# EAGLE design Geniric_220VAC_24VDC_cup_wash (EAGLE 8.5.1)

## Sheet 1 of 2: 220v AC INPUT
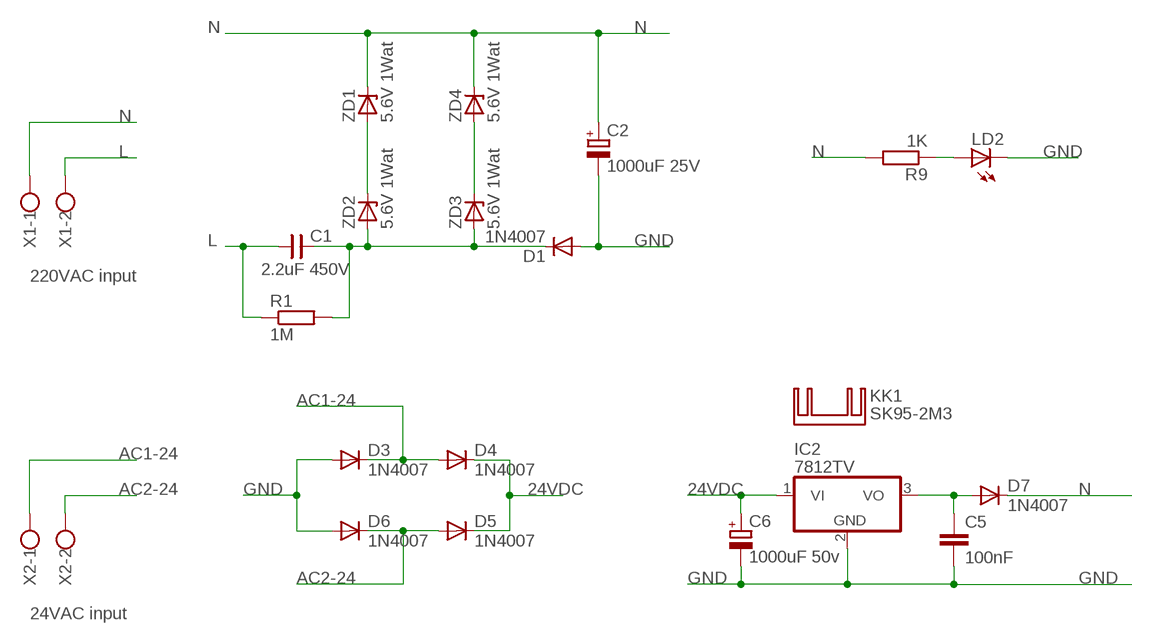
[diagram p0: schematic, sheet 1]

### Parts
C1  2.2uF 450V  CNP-C150-190X070  [C150-190X070]
C2  1000uF 25V  CPOL-EUE5-8.5  [E5-8,5]
C5  100nF  C-EU050-025X075  [C050-025X075]
C6  1000uF 50v  CPOL-EUE5-13  [E5-13]
D1  1N4007  1N4004  [DO41-10]
D3  1N4007  1N4004  [DO41-10]
D4  1N4007  1N4004  [DO41-10]
D5  1N4007  1N4004  [DO41-10]
D6  1N4007  1N4004  [DO41-10]
D7  1N4007  1N4004  [DO41-10]
IC2  7812TV  [TO220V]
KK1  SK95-2M3  [SK95-2M3]
LD2  LED5MM  [LED5MM]
R1  1M  R-EU_0207/10  [0207/10]
R9  1K  R-EU_0207/10  [0207/10]
X1  W237-102  [W237-102]
X2  W237-102  [W237-102]
ZD1  5.6V 1Wat  ZD-DO35Z10  [DO35Z10]
ZD2  5.6V 1Wat  ZD-DO35Z10  [DO35Z10]
ZD3  5.6V 1Wat  ZD-DO35Z10  [DO35Z10]
ZD4  5.6V 1Wat  ZD-DO35Z10  [DO35Z10]

### Nets
24VDC: C6.+ D4.C D5.C IC2.1(VI) ; also sheet 2
AC1-24: D3.C D4.A X2.1 ; also sheet 2
AC2-24: D5.A D6.C X2.2 ; also sheet 2
GND: C2.- C5.2 C6.- D1.A D3.A D6.A IC2.2(GND) LD2.K(C) ; also sheet 2
L: C1.1 R1.1 X1.2 ; also sheet 2
N: C2.+ D7.C R9.2 X1.1 ZD1.C ZD4.C ; also sheet 2
N$4: C1.2 D1.C R1.2 ZD2.A ZD3.A
N$7: ZD1.A ZD2.C
N$8: ZD3.C ZD4.A
N$9: LD2.A R9.1
NDDD: C5.1 D7.A IC2.3(VO)

### Notes on the sheet
- 220VAC input
- 24VAC input

## Sheet 2 of 2
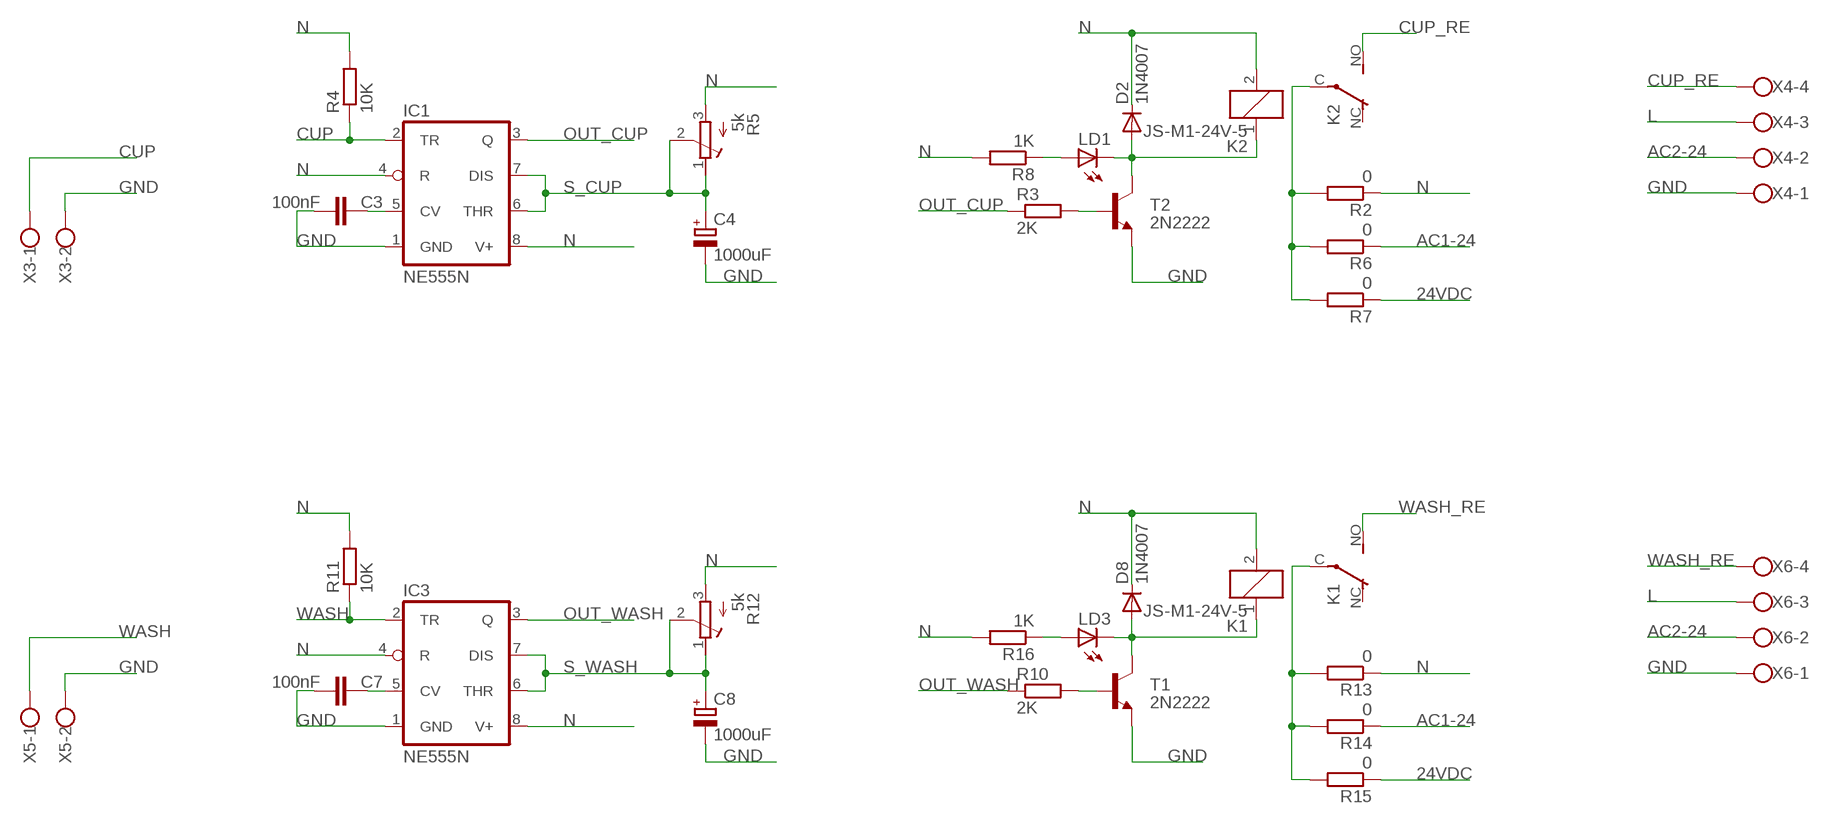
[diagram p1: schematic, sheet 2]

### Parts
C3  100nF  C-EU050-025X075  [C050-025X075]
C4  1000uF  CPOL-EUE5-8.5  [E5-8,5]
C7  100nF  C-EU050-025X075  [C050-025X075]
C8  1000uF  CPOL-EUE5-8.5  [E5-8,5]
D2  1N4007  1N4004  [DO41-10]
D8  1N4007  1N4004  [DO41-10]
IC1  NE555N  [DIL08-ROUND]
IC3  NE555N  [DIL08-ROUND]
K1  JS-M1-24V-5  JS-M1-12V-5  [JS-M]
K2  JS-M1-24V-5  JS-M1-12V-5  [JS-M]
LD1  LED5MM  [LED5MM]
LD3  LED5MM  [LED5MM]
R2  0  R-EU_0207/10  [0207/10]
R3  2K  R-EU_0207/10  [0207/10]
R4  10K  R-EU_0207/10  [0207/10]
R5  5k  R-TRIMMT93XA  [RTRIMT93XA]
R6  0  R-EU_0207/10  [0207/10]
R7  0  R-EU_0207/10  [0207/10]
R8  1K  R-EU_0207/10  [0207/10]
R10  2K  R-EU_0207/10  [0207/10]
R11  10K  R-EU_0207/10  [0207/10]
R12  5k  R-TRIMMT93XA  [RTRIMT93XA]
R13  0  R-EU_0207/10  [0207/10]
R14  0  R-EU_0207/10  [0207/10]
R15  0  R-EU_0207/10  [0207/10]
R16  1K  R-EU_0207/10  [0207/10]
T1  2N2222  [TO92-EBC-OVAL]
T2  2N2222  [TO92-EBC-OVAL]
X3  W237-102  [W237-102]
X4  W237-4  [W237-4]
X5  W237-102  [W237-102]
X6  W237-4  [W237-4]

### Nets
24VDC: R7.1 R15.1 ; also sheet 1
AC1-24: R6.1 R14.1 ; also sheet 1
AC2-24: X4.2 X6.2 ; also sheet 1
CUP: IC1.2(TR) R4.1 X3.1
CUP_RE: K2.NO(2:S) X4.4
GND: C3.2 C4.- C7.2 C8.- IC1.1(GND) IC3.1(GND) T1.E T2.E X3.2 X4.1 X5.2 X6.1 ; also sheet 1
L: X4.3 X6.3 ; also sheet 1
N: D2.C D8.C IC1.4(R) IC1.8(V+) IC3.4(R) IC3.8(V+) K1.2 K2.2 R2.1 R4.2 R5.3(A) R8.2 R11.2 R12.3(A) R13.1 R16.2 ; also sheet 1
N$1: R3.2 T2.B
N$2: C3.1 IC1.5(CV)
N$3: D2.A K2.1 LD1.K(C) T2.C
N$5: C7.1 IC3.5(CV)
N$6: LD1.A R8.1
N$10: K2.C(2:P) R2.2 R6.2 R7.2
N$11: D8.A K1.1 LD3.K(C) T1.C
N$12: R10.2 T1.B
N$13: K1.C(2:P) R13.2 R14.2 R15.2
N$14: LD3.A R16.1
OUT_CUP: IC1.3(Q) R3.1
OUT_WASH: IC3.3(Q) R10.1
S_CUP: C4.+ IC1.6(THR) IC1.7(DIS) R5.1(E) R5.2(S)
S_WASH: C8.+ IC3.6(THR) IC3.7(DIS) R12.1(E) R12.2(S)
WASH: IC3.2(TR) R11.1 X5.1
WASH_RE: K1.NO(2:S) X6.4
Unconnected: K1.NC(2:O) K2.NC(2:O)

## Library data of the parts
C1 = cap-master:CNP-: NON-POLARIZED CAP
C2 C4 C6 C8 = rcl:CPOL-EU: POLARIZED CAPACITOR, European symbol; SPICEPREFIX: C
C3 C5 C7 = rcl:C-EU: CAPACITOR, European symbol; SPICEPREFIX: C
D1-D8 = adafruit:1N4004: DIODE General purpose 1N400x type rectifier (With bigger pads) http://www.ladyada.net/library/pcb/eaglelibrary.html
IC1 IC3 = adafruit:*555: TIMER Changed DIP package to have round (not oval) pin pads http://www.ladyada.net/library/pcb/eaglelibrary.html
IC2 = linear:78*: Positive VOLTAGE REGULATOR Source: http://cache.national.com/ds/LM/LM78L05.pdf http://www.fairchildsemi.com/ds/LM/LM7805.pdf
K1 K2 = relay:JS-M1*: Automotive Ultra-Miniature Power Relay NAiS Source: http://www.mew-europe.com/.. en_ds_61211_0000.pdf; MF: FARNELL; MPN: JSM1-12V-5; OC_FARNELL: 910351; OC_NEWARK: 14J1764
KK1 = heatsink:SK95-2M3: HEATSINK manufacturer Fischer/distributor Buerklin
LD1-LD3 = led:LED: LED OSRAM: - CHIPLED LG R971, LG N971, LY N971, LG Q971, LY Q971, LO R971, LY R971 LH N974, LH R974 LS Q976, LO Q976, LY Q976 LO Q996 - Hyper CHIPLED LW Q18S LB Q993, LB Q99A, LB R99A - SideLED LS A670, LO A670, LY A670, LG A670, LP A670 LB A673, LV A673, LT A673, LW A673 LH A674 LY A675 LS A676, LA A676, LO A676, LY A676, LW A676 LS A679, LY A679, LG A679 - Hyper Micro SIDELED® LS Y876, LA Y876, LO Y876, LY Y876 LT Y87S - SmartLED LW L88C, LW L88S LB L89C, LB L89S, LG L890 LS L89K, LO L89K, LY L89K LS L896, LA L896, LO L896, LY L896 - TOPLED LS T670, LO T670, LY T670, LG T670, LP T670 LSG T670, LSP T670, LSY T670, LOP T670, LYG T670 LG T671, LOG T671, LSG T671 LB T673, LV T673, LT T673, LW T673 LH T674 LS T676, LA T676, LO T676, LY T676, LB T676, LH T676, LSB T676, LW T676 LB T67C, LV T67C, LT T67C, LS T67K, LO T67K, LY T67K, LW E67C LS E67B, LA E67B, LO E67B, LY E67B, LB E67C, LV E67C, LT E67C LW T67C LS T679, LY T679, LG T679 LS T770, LO T770, LY T770, LG T770, LP T770 LB T773, LV T773, LT T773, LW T773 LH T774 LS E675, LA E675, LY E675, LS T675 LS T776, LA T776, LO T776, LY T776, LB T776 LHGB T686 LT T68C, LB T68C - Hyper Mini TOPLED® LB M676 - Mini TOPLED Santana® LG M470 LS M47K, LO M47K, LY M47K Source: http://www.osram.convergy.de/
R1 = rcl:R-EU_: RESISTOR, European symbol; SPICEPREFIX: R
R2-R4 R6-R11 R13-R16 = rcl-2:R-EU_: RESISTOR, European symbol
R5 R12 = rcl:R-TRIMM: Trimm resistor; SPICEMODEL: X; SPICEPREFIXL: POT
T1 T2 = adafruit:2N2222: NPN TRANSISTOR Big oval pads
X1-X3 X5 = con-wago-500:W237-102: WAGO SCREW CLAMP
X4 X6 = con-wago-500:W237-4: WAGO SCREW CLAMP; OC_FARNELL: unknown; OC_NEWARK: unknown
ZD1-ZD4 = diodes:ZD-: Zener diode

## Board
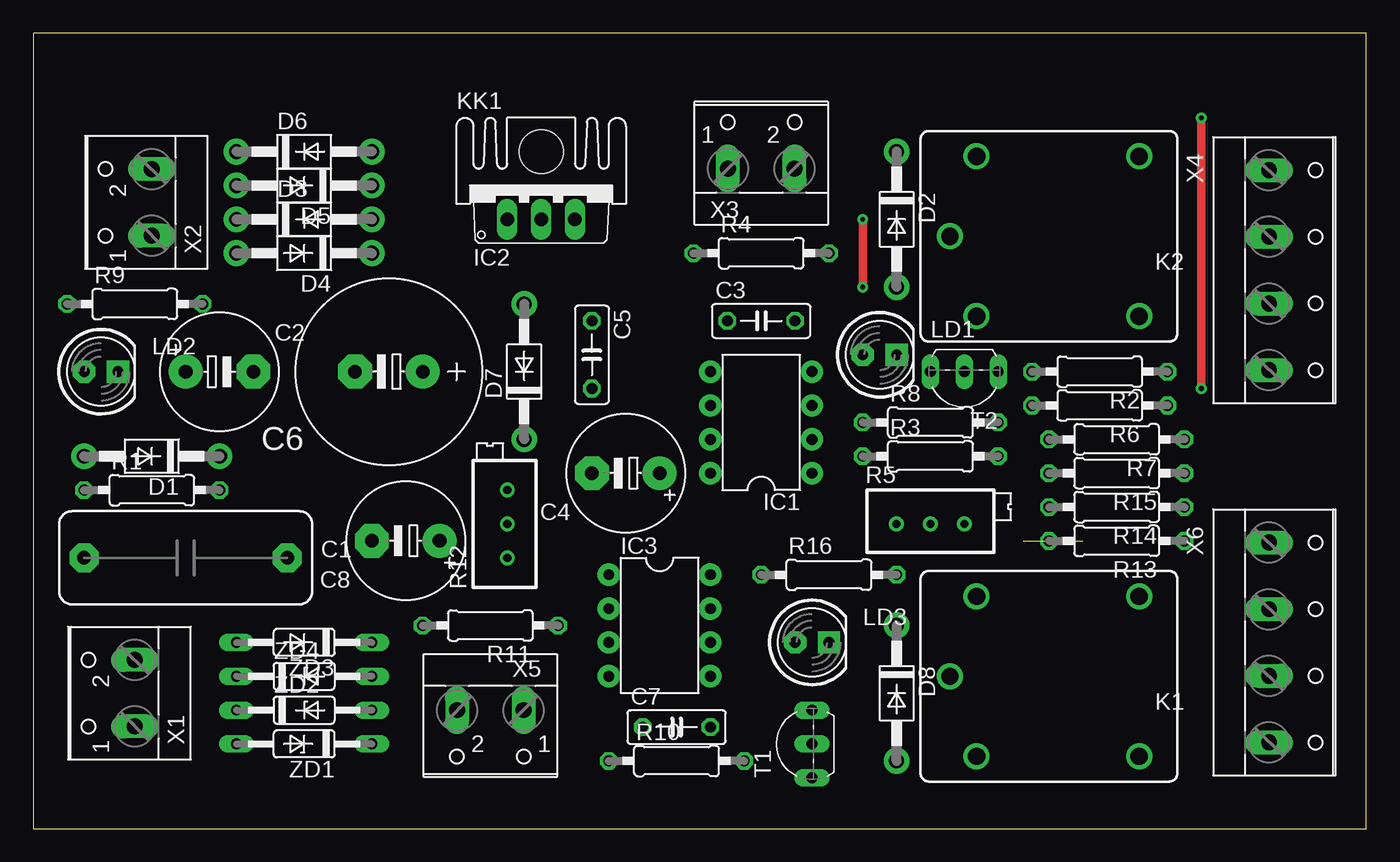
[diagram p2: board, top side]
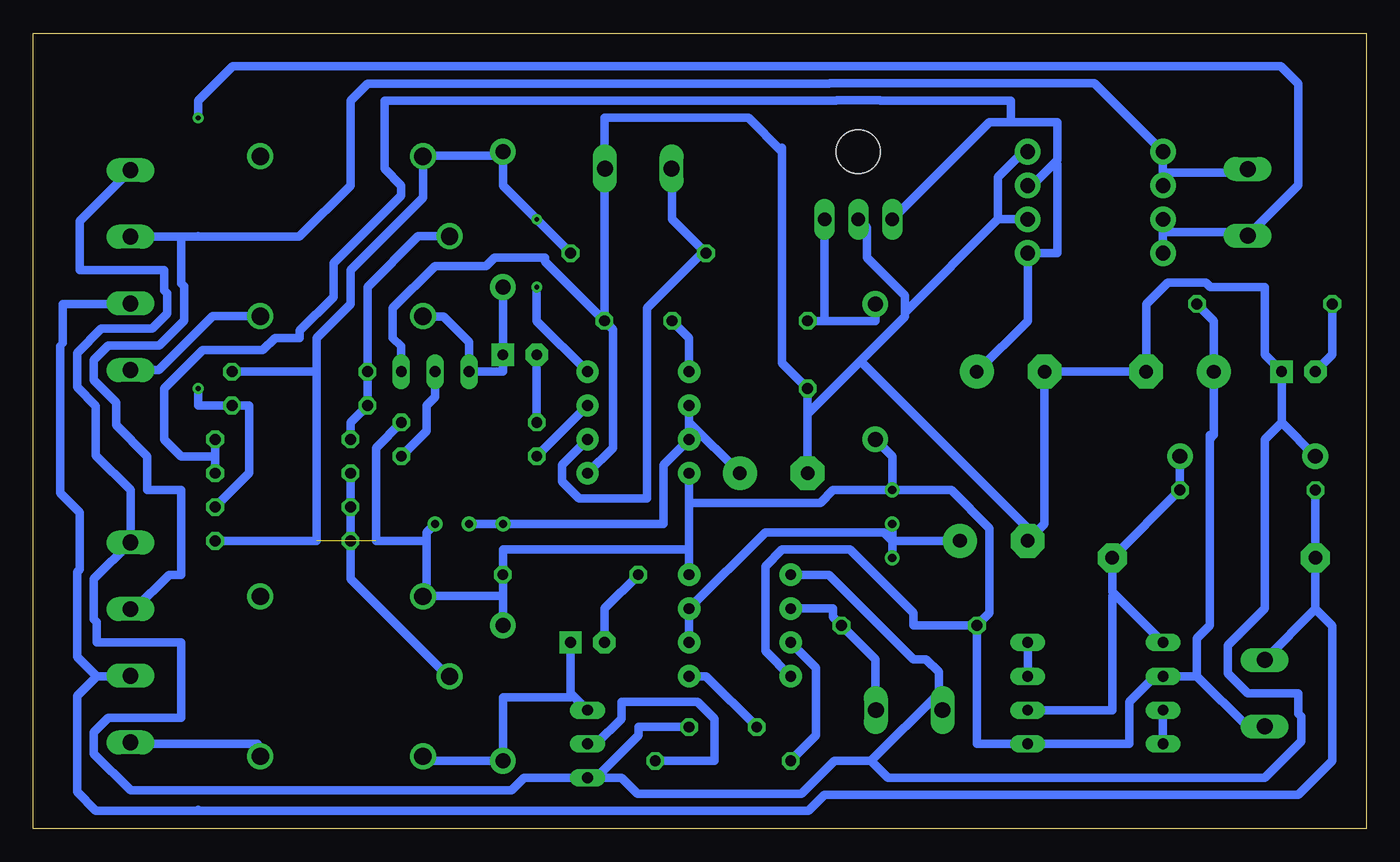
[diagram p3: board, bottom side, seen from below]

Size 100 x 59.68 mm. Coordinates in mm from the lower left corner, seen from the top.
Outline: 0,0 100,0 100,59.68 0,59.68 0,0
Copper layers (1*16): Top 0.035mm / dielectric 1.5mm / Bottom 0.035mm
Design rules "default *": minimum track width 25mil, minimum drill 0.35mm, track to track 25mil, track to pad 25mil, pad to pad 6mil, via to via 6mil, smd to smd 6mil, copper to edge 40mil, drill to drill 6mil, minimum pad ring 10mil, minimum via ring 8mil, stop-mask expansion 4mil, vias tented up to drill 0mil, thermal gap 10mil

### Footprints (pad centres in the part's own frame; a part is rotated, then mirrored left to right if it is on the bottom)
C150-190X070 = drill 1.016 pad 2.184 octagon: 1 -7.62,0; 2 7.62,0
E5-8,5 = drill 1.016 pad 2.54: + -2.54,0 | drill 1.016 pad 2.54 octagon: - 2.54,0
C050-025X075 = drill 0.813 octagon: 1 -2.54,0; 2 2.54,0
E5-13 = drill 1.016 pad 2.54: + -2.54,0 | drill 1.016 pad 2.54 octagon: - 2.54,0
DO41-10 = drill 1.118 pad 1.93: A 5.08,0; C -5.08,0
DIL08-ROUND = drill 0.813 pad 1.676: 1 -3.81,-3.81; 2 -1.27,-3.81; 3 1.27,-3.81; 4 3.81,-3.81; 5 3.81,3.81; 6 1.27,3.81; 7 -1.27,3.81; 8 -3.81,3.81
TO220V = drill 1.016 long: 1 -2.54,-2.54; 2 0,-2.54; 3 2.54,-2.54
JS-M = drill 1.3: 1 6.7,6; 2 6.7,-6; C 8.7,0; NC -5.5,-6; NO -5.5,6
SK95-2M3 = hole 3.302: 0,2.54
LED5MM = drill 0.813 pad 1.676 octagon: A -1.27,0 | drill 0.813 pad 1.676 square: K 1.27,0
0207/10 = drill 0.813 octagon: 1 -5.08,0; 2 5.08,0
RTRIMT93XA = drill 0.61: 1 0,-2.54; 2 0,0; 3 0,2.54
TO92-EBC-OVAL = drill 0.813 long: B 0,-1.27; C 2.54,-1.27; E -2.54,-1.27
W237-102 = drill 1.194 long: 1 -2.5,-1.27; 2 2.5,-1.27
W237-4 = drill 1.194 long: 1 -7.5,-1.27; 2 -2.5,-1.27; 3 2.5,-1.27; 4 7.5,-1.27
DO35Z10 = drill 0.813 long: A 5.08,0; C -5.08,0

### Placement (x,y rotation side)
C1  11.43,20.32 0 top
C2  13.97,34.29 0 top
C3  54.61,38.1 0 top
C4  44.45,26.67 180 top
C5  41.91,35.56 270 top
C6  26.67,34.29 180 top
C7  48.26,7.62 0 top
C8  27.94,21.59 180 top
D1  8.89,27.94 180 top
D2  64.77,45.72 270 top
D3  20.32,45.72 0 top
D4  20.32,43.18 180 top
D5  20.32,48.26 180 top
D6  20.32,50.8 0 top
D7  36.83,34.29 90 top
D8  64.77,10.16 270 top
IC1  54.61,30.48 90 top
IC2  38.1,48.26 0 top
IC3  46.99,15.24 270 top
K1  77.47,11.43 180 top
K2  77.47,44.45 180 top
KK1  38.1,48.26 0 top
LD1  63.5,35.56 0 top
LD2  5.08,34.29 0 top
LD3  58.42,13.97 0 top
R1  8.89,25.4 0 top
R2  80.01,34.29 180 top
R3  67.31,27.94 0 top
R4  54.61,43.18 0 top
R5  67.31,22.86 270 top
R6  80.01,31.75 180 top
R7  81.28,29.21 180 top
R8  67.31,30.48 0 top
R9  7.62,39.37 0 top
R10  48.26,5.08 0 top
R11  34.29,15.24 180 top
R12  35.56,22.86 0 top
R13  81.28,21.59 180 top
R14  81.28,24.13 180 top
R15  81.28,26.67 180 top
R16  59.69,19.05 0 top
T1  57.15,6.35 90 top
T2  69.85,33.02 180 top
X1  6.35,10.16 90 top
X2  7.62,46.99 90 top
X3  54.61,50.8 0 top
X4  93.98,41.91 270 top
X5  34.29,7.62 180 top
X6  93.98,13.97 270 top
ZD1  20.32,6.35 180 top
ZD2  20.32,8.89 0 top
ZD3  20.32,13.97 180 top
ZD4  20.32,11.43 0 top

### Tracks (layer width: path | path; a pad name or v marks a point on that pad's centre or on a via)
24VDC
  Bottom 0.635: IC2.1 28.26,53.02 26.67,53.02 | 26.67,53.02 23.18,53.02 23.18,50.16 23.34,50.01 | 23.34,50.01 25.08,48.26 D5.C | 23.34,50.01 23.18,49.85 23.18,43.18 D4.C 25.4,38.1 C6.+ | 26.67,53.02 26.67,54.61 36.43,54.61 36.5,54.67 39.7,54.67 39.77,54.61 73.66,54.61 73.66,49.53 72.39,48.26 72.39,47.52 77.47,42.44 77.47,39.9 80.01,37.36 80.01,36.83 81.86,36.83 82.79,35.9 87.29,35.9 90.17,33.02 90.17,29.21 88.9,27.94 86.36,27.94 | R15.1 86.36,27.94 | 86.36,27.94 R7.1
AC1-24  (via drill 0.35 pad 0.8)
  Top 0.635: v87.63,53.34 v87.63,33.02
  Bottom 0.635: 15.24,44.77 8.89,44.77 X2.1 5.08,48.3 5.08,55.88 6.41,57.21 85.03,57.21 87.63,54.61 v87.63,53.34 | 15.24,44.77 D4.A | 15.24,44.77 D3.C | R14.1 83.82,26.67 83.82,31.75 R6.1 87.63,31.75 v87.63,33.02
AC2-24
  Bottom 0.635: 15.24,49.21 8.89,49.21 X2.2 | 15.24,49.21 D6.C 20.38,55.94 40.23,55.94 40.29,55.88 74.93,55.88 76.2,54.61 76.2,48.26 80.05,44.41 87.67,44.41 | 15.24,49.21 D5.A | 92.71,44.13 X4.2 88.9,44.41 | 87.63,44.45 87.67,44.41 | 87.67,44.41 88.9,44.41 | X6.2 92.38,16.47 89.8,19.05 88.9,19.05 88.9,25.4 91.44,25.4 91.44,27.94 93.77,30.27 93.77,31.96 95.45,33.65 95.45,35.17 94.37,36.26 90.56,36.26 88.7,38.12 88.7,40.7 88.9,40.91 88.9,44.41
CUP
  Bottom 0.635: X3.1 52.07,48.26 52.07,45.72 R4.1 49.85,43.18 53.98,39.05 53.98,24.77 59.05,24.77 60.33,26.04 60.33,27.3 IC1.2
CUP_RE
  Bottom 0.635: 91.44,34.29 92.59,34.29 X4.4 90.58,34.41 86.54,38.45 K2.NO
GND
  Bottom 0.635: C7.2 54.61,7.62 54.61,6.99 57.78,3.81 T1.E | X6.1 92.71,21.59 92.42,21.88 | 92.71,49.21 X4.1 96.52,45.6 96.52,41.91 90.17,41.91 90.17,40.38 89.97,40.17 89.97,38.65 91.08,37.53 94.9,37.53 96.72,35.7 96.72,33.12 95.3,31.7 95.3,27.99 92.71,25.4 X6.1 | T1.E 63.18,3.81 64.14,2.86 92.71,2.86 95.45,5.6 95.45,7.24 94.37,8.32 88.9,8.32 88.9,13.97 95.25,13.97 95.25,15.5 95.45,15.71 95.45,18.73 X6.1 | C3.2 57.15,48.26 X3.2 | C3.2 61.59,42.55 61.59,42.86 65.41,42.86 66.04,42.23 69.85,42.23 73.03,39.05 73.03,36.83 72.39,36.2 T2.E | IC1.1 56.52,28.57 56.52,37.47 C3.2 | 27.62,45.72 D3.A | 27.62,45.72 27.62,48.9 25.72,50.8 D6.A | 41.91,31.11 C4.- 41.83,26.75 | 41.91,31.11 C5.2 43.81,34.92 43.81,50.8 | IC2.2 37.47,45.09 37.47,42.86 34.61,40.01 34.61,38.73 | 34.61,38.73 34.61,38.42 37.94,35.08 | 41.91,31.11 37.94,35.08 | 34.61,38.73 27.62,45.72 | 43.81,50.8 43.81,51.12 | 56.83,48.26 X3.2 | 32.07,10.16 X5.2 | 6.35,30.48 D1.A | 6.35,30.48 LD2.K 7.62,35.56 7.62,40.64 11.69,40.64 12.03,40.98 14.9,40.98 16.51,39.37 C2.- C6.- 24.13,22.86 C8.- 25.08,22.23 37.94,35.08 | IC3.1 40.32,19.05 33.97,12.7 33.02,12.7 32.07,11.75 32.07,10.16 | T1.E 55.88,3.81 54.67,2.6 42.37,2.6 39.9,5.08 37.15,5.08 | 37.15,5.08 32.07,10.16 | 37.15,5.08 35.88,3.81 7.62,3.81 4.88,6.55 4.88,8.43 5.08,8.63 5.08,10.16 8.89,10.16 10.36,11.63 10.36,13.77 7.62,16.51 7.62,29.21 6.35,30.48 | 43.81,50.8 46.35,53.34 57.15,53.34 57.15,49.57 X3.2
L
  Bottom 0.635: R1.1 C1.1 3.81,16.47 | 7.62,12.7 X1.2 3.81,16.47 | 3.81,16.47 2.54,15.2 2.54,5.08 5.08,2.54 40.64,2.54 41.85,1.33 87.55,1.33 | 87.55,1.33 87.63,1.42 | 94.02,11.47 X6.3 92.71,11.43 95.25,11.43 | X4.3 92.75,39.37 97.79,39.37 97.79,36.43 97.99,36.23 97.99,25.18 96.52,23.71 96.52,19.46 96.72,19.25 96.72,12.9 95.25,11.43 | 95.25,11.43 96.72,9.96 96.72,2.74 95.31,1.33 87.55,1.33
N  (via drill 0.35 pad 0.8)  (1 unrouted)
  Top 0.635: v62.23,40.64 v62.23,45.72
  Bottom 0.635: R11.2 29.21,6.35 ZD1.C 17.78,6.35 17.78,9.53 15.88,11.43 ZD4.C 12.7,11.43 | IC3.4 45.09,13.34 45.09,19.68 43.81,20.95 38.73,20.95 33.97,16.19 33.97,15.24 R11.2 | 7.62,7.94 X1.1 7.62,7.62 8.89,7.62 12.7,11.43 | 11.75,29.21 11.75,15.24 12.7,14.29 12.7,11.43 | 11.75,29.21 11.75,29.53 | IC1.8 50.8,24.45 | 50.8,24.45 50.8,20.95 | 50.8,20.95 IC3.8 | R12.3 40.01,25.4 40.96,24.45 50.8,24.45 | R4.2 v62.23,45.72 64.77,48.26 64.77,50.48 | 64.77,50.48 70.48,50.48 K2.2 70.77,47.34 76.2,41.91 76.2,39.37 78.74,36.83 78.74,34.29 | 64.77,50.48 D2.C | D8.C 64.77,17.46 | 64.77,17.46 R16.2 64.77,20.95 50.8,20.95 | R5.3 70.48,22.23 70.48,21.59 | 70.48,21.59 70.48,17.46 K1.2 70.17,17.46 64.77,17.46 | 70.48,21.59 74.3,21.59 74.3,28.57 R8.2 | R11.2 28.26,16.19 28.26,22.54 31.11,25.4 R12.3 | R12.3 35.56,27.94 D7.C | R9.2 11.43,38.1 C2.+ 11.43,29.53 11.75,29.21 | R13.1 78.74,21.59 78.74,34.29 | R2.1 78.74,34.29 | IC1.4 62.23,38.1 v62.23,40.64
N$1
  Bottom 0.635: R3.2 70.48,29.84 70.48,31.75 69.85,32.38 T2.B
N$2
  Bottom 0.635: C3.1 50.8,36.83 IC1.5
N$3
  Bottom 0.635: D2.A LD1.K 64.77,34.29 T2.C 67.31,36.51 69.22,38.42 70.48,38.42 K2.1
N$4
  Bottom 0.635: D1.C R1.2 C1.2 19.05,17.78 18.89,17.62 | 18.89,17.62 ZD3.A | ZD2.A 19.05,8.89 19.05,17.46 18.89,17.62
N$5
  Bottom 0.635: C7.1 49.53,11.43 IC3.5
N$6
  Bottom 0.635: LD1.A R8.1
N$7
  Bottom 0.635: ZD2.C ZD1.A
N$8
  Bottom 0.635: ZD3.C ZD4.A
N$9
  Bottom 0.635: R9.1 2.54,35.56 LD2.A
N$10
  Bottom 0.635: K2.C 71.12,44.45 74.93,40.64 R2.2 R6.2 76.2,30.48 R7.2
N$11
  Bottom 0.635: 59.53,10 59.69,10.16 LD3.K | 59.53,10 T1.C | K1.1 70.48,5.4 70.48,5.08 D8.A 64.77,9.84 59.69,9.84 59.53,10
N$12
  Bottom 0.635: R10.2 48.9,5.08 48.9,8.26 50.16,9.53 55.88,9.53 55.88,8.26 57.78,6.35 T1.B
N$13
  Bottom 0.635: K1.C 68.9,11.43 76.2,18.73 R13.2 R14.2 R15.2
N$14
  Bottom 0.635: R16.1 57.15,16.51 LD3.A
NDDD
  Bottom 0.635: 40.64,38.1 36.83,38.1 D7.A | 40.64,38.1 C5.1 | 40.64,38.1 IC2.3
OUT_CUP
  Bottom 0.635: IC1.3 R3.1
OUT_WASH
  Bottom 0.635: IC3.3 41.27,12.06 41.27,6.99 R10.1
S_CUP
  Bottom 0.635: R5.2 R5.1 52.7,22.86 52.7,27.3 IC1.7 50.8,30.48 | 50.8,30.48 IC1.6 | 50.8,30.48 C4.+
S_WASH
  Bottom 0.635: IC3.6 IC3.7 45.09,22.23 36.2,22.23 35.56,21.59 | C8.+ 35.56,21.59 | 35.56,21.59 R12.2 | R12.1 35.56,21.59
WASH
  Bottom 0.635: X5.1 36.83,10.16 36.83,12.7 R11.1 40.01,15.88 40.01,16.51 IC3.2
WASH_RE
  Bottom 0.635: X6.4 92.71,6.35 83.19,6.35 83.19,5.71 K1.NO